# EAGLE design LARS (EAGLE 9.1.3)
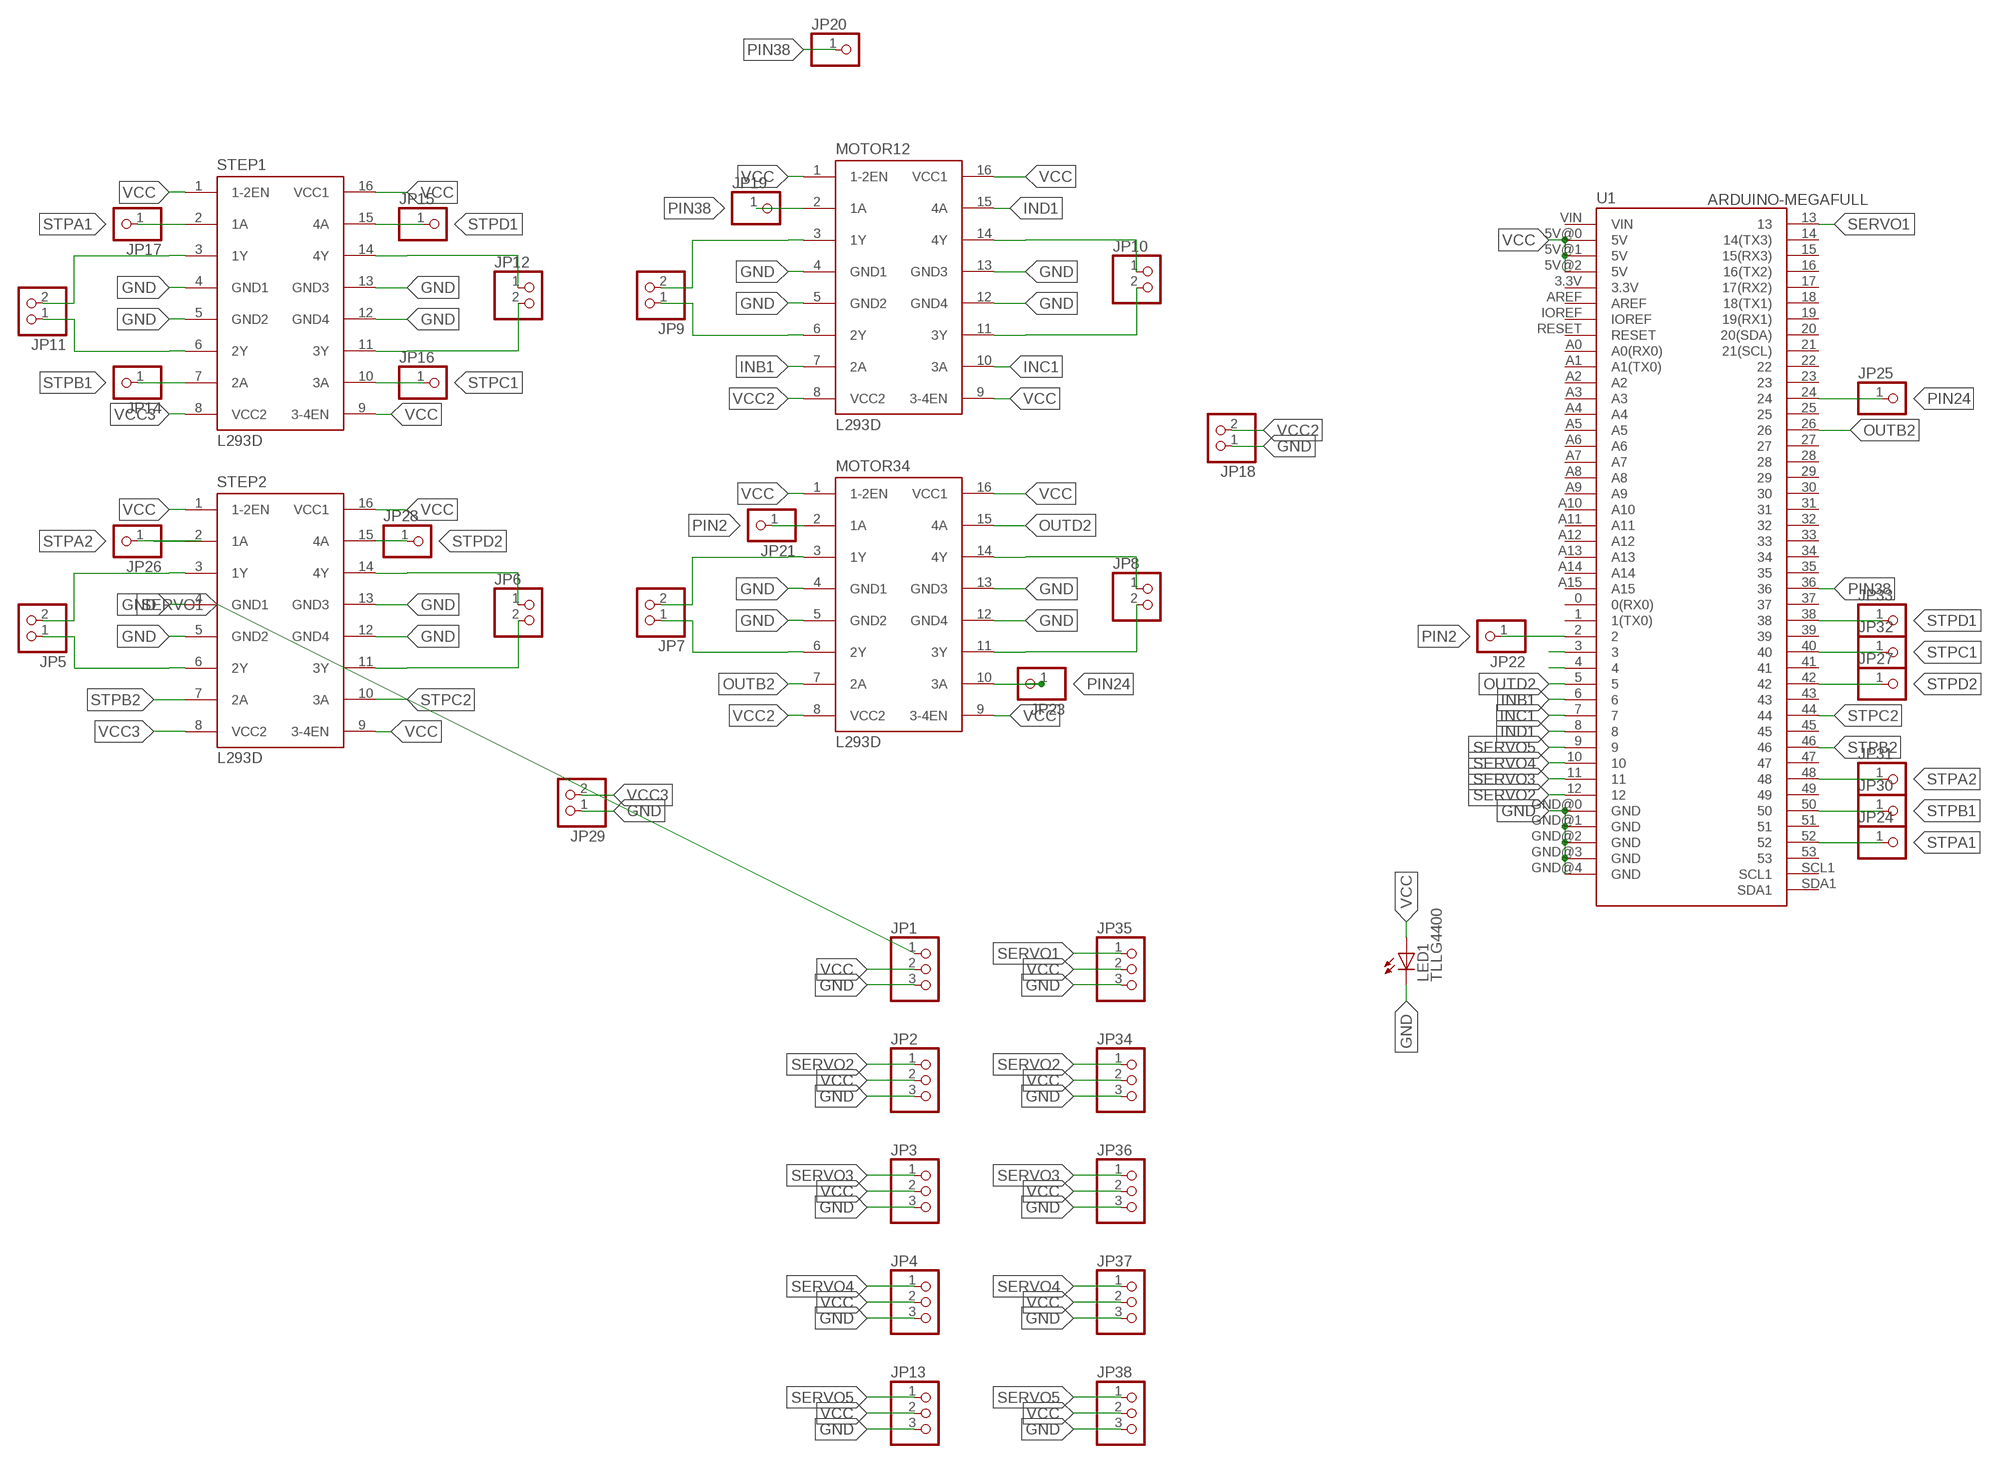
[diagram p0: schematic, sheet 1]

## Parts
JP1  PINHD-1X3  [1X03]
JP2  PINHD-1X3  [1X03]
JP3  PINHD-1X3  [1X03]
JP4  PINHD-1X3  [1X03]
JP5  PINHD-1X2  [1X02]
JP6  PINHD-1X2  [1X02]
JP7  PINHD-1X2  [1X02]
JP8  PINHD-1X2  [1X02]
JP9  PINHD-1X2  [1X02]
JP10  PINHD-1X2  [1X02]
JP11  PINHD-1X2  [1X02]
JP12  PINHD-1X2  [1X02]
JP13  PINHD-1X3  [1X03]
JP14  PINHD-1X1  [1X01]
JP15  PINHD-1X1  [1X01]
JP16  PINHD-1X1  [1X01]
JP17  PINHD-1X1  [1X01]
JP18  PINHD-1X2  [1X02]
JP19  PINHD-1X1  [1X01]
JP20  PINHD-1X1  [1X01]
JP21  PINHD-1X1  [1X01]
JP22  PINHD-1X1  [1X01]
JP23  PINHD-1X1  [1X01]
JP24  PINHD-1X1  [1X01]
JP25  PINHD-1X1  [1X01]
JP26  PINHD-1X1  [1X01]
JP27  PINHD-1X1  [1X01]
JP28  PINHD-1X1  [1X01]
JP29  PINHD-1X2  [1X02]
JP30  PINHD-1X1  [1X01]
JP31  PINHD-1X1  [1X01]
JP32  PINHD-1X1  [1X01]
JP33  PINHD-1X1  [1X01]
JP34  PINHD-1X3  [1X03]
JP35  PINHD-1X3  [1X03]
JP36  PINHD-1X3  [1X03]
JP37  PINHD-1X3  [1X03]
JP38  PINHD-1X3  [1X03]
LED1  TLLG4400  [LED3MM]
MOTOR12  L293D  [DIL16]
MOTOR34  L293D  [DIL16]
STEP1  L293D  [DIL16]
STEP2  L293D  [DIL16]
U1  ARDUINO-MEGAFULL  [ARDUINO_MEGA]

## Nets
GND: JP1.3 JP2.3 JP3.3 JP4.3 JP13.3 JP18.1 JP29.1 JP34.3 JP35.3 JP36.3 JP37.3 JP38.3 LED1.K(C) MOTOR12.4(GND1) MOTOR12.5(GND2) MOTOR12.12(GND4) MOTOR12.13(GND3) MOTOR34.4(GND1) MOTOR34.5(GND2) MOTOR34.12(GND4) MOTOR34.13(GND3) STEP1.4(GND1) STEP1.5(GND2) STEP1.12(GND4) STEP1.13(GND3) STEP2.4(GND1) STEP2.5(GND2) STEP2.12(GND4) STEP2.13(GND3) U1.GND@0(GND) U1.GND@1(GND) U1.GND@2(GND) U1.GND@3(GND) U1.GND@4(GND)
INB1: MOTOR12.7(2A) U1.6
INC1: MOTOR12.10(3A) U1.7
IND1: MOTOR12.15(4A) U1.8
N$4: U1.4
N$5: U1.3
OUTB2: MOTOR34.7(2A) U1.26
OUTD2: MOTOR34.15(4A) U1.5
PIN2: JP21.1 JP22.1 MOTOR34.2(1A) U1.2
PIN24: JP23.1 JP25.1 MOTOR34.10(3A) U1.24
PIN38: JP19.1 JP20.1 MOTOR12.2(1A) U1.36
SERVO1: JP1.1 JP35.1 U1.13
SERVO2: JP2.1 JP34.1 U1.12
SERVO3: JP3.1 JP36.1 U1.11
SERVO4: JP4.1 JP37.1 U1.10
SERVO5: JP13.1 JP38.1 U1.9
STP1: JP5.2 STEP2.3(1Y)
STP2: JP5.1 STEP2.6(2Y)
STP3: JP6.2 STEP2.11(3Y)
STP4: JP6.1 STEP2.14(4Y)
STP5: JP7.2 MOTOR34.3(1Y)
STP6: JP7.1 MOTOR34.6(2Y)
STP7: JP8.2 MOTOR34.11(3Y)
STP8: JP8.1 MOTOR34.14(4Y)
STP9: JP9.2 MOTOR12.3(1Y)
STP10: JP9.1 MOTOR12.6(2Y)
STP11: JP10.2 MOTOR12.11(3Y)
STP12: JP10.1 MOTOR12.14(4Y)
STP13: JP11.2 STEP1.3(1Y)
STP14: JP11.1 STEP1.6(2Y)
STP15: JP12.2 STEP1.11(3Y)
STP16: JP12.1 STEP1.14(4Y)
STPA1: JP17.1 JP24.1 STEP1.2(1A) U1.52
STPA2: JP26.1 JP31.1 STEP2.2(1A) U1.48
STPB1: JP14.1 JP30.1 STEP1.7(2A) U1.50
STPB2: STEP2.7(2A) U1.46
STPC1: JP16.1 JP32.1 STEP1.10(3A) U1.40
STPC2: STEP2.10(3A) U1.44
STPD1: JP15.1 JP33.1 STEP1.15(4A) U1.38
STPD2: JP27.1 JP28.1 STEP2.15(4A) U1.42
VCC: JP1.2 JP2.2 JP3.2 JP4.2 JP13.2 JP34.2 JP35.2 JP36.2 JP37.2 JP38.2 LED1.A MOTOR12.1(1-2EN) MOTOR12.9(3-4EN) MOTOR12.16(VCC1) MOTOR34.1(1-2EN) MOTOR34.9(3-4EN) MOTOR34.16(VCC1) STEP1.1(1-2EN) STEP1.9(3-4EN) STEP1.16(VCC1) STEP2.1(1-2EN) STEP2.9(3-4EN) STEP2.16(VCC1) U1.5V@0(5V) U1.5V@1(5V) U1.5V@2(5V)
VCC2: JP18.2 MOTOR12.8(VCC2) MOTOR34.8(VCC2)
VCC3: JP29.2 STEP1.8(VCC2) STEP2.8(VCC2)
Unconnected: U1.0(0(RX0)) U1.1(1(TX0)) U1.3.3V U1.14(14(TX3)) U1.15(15(RX3)) U1.16(16(TX2)) U1.17(17(RX2)) U1.18(18(TX1)) U1.19(19(RX1)) U1.20(20(SDA)) U1.21(21(SCL)) U1.22 U1.23 U1.25 U1.27 U1.28 U1.29 U1.30 U1.31 U1.32 U1.33 U1.34 U1.35 U1.37 U1.39 U1.41 U1.43 U1.45 U1.47 U1.49 U1.51 U1.53 U1.A0(A0(RX0)) U1.A1(A1(TX0)) U1.A2 U1.A3 U1.A4 U1.A5 U1.A6 U1.A7 U1.A8 U1.A9 U1.A10 U1.A11 U1.A12 U1.A13 U1.A14 U1.A15 U1.AREF U1.IOREF U1.RESET U1.SCL1 U1.SDA1 U1.VIN

## Library data of the parts
JP1-JP4 JP13 JP34-JP38 = pinhead:PINHD-1X3: PIN HEADER
JP5-JP12 JP18 JP29 = pinhead:PINHD-1X2: PIN HEADER
JP14-JP17 JP19-JP28 JP30-JP33 = pinhead:PINHD-1X1: PIN HEADER
LED1 = led:TLLG4400: Low Current (2mA) LED 3 mm Tinted Diffused Package color GREEN Source: Data sheet <http://www.farnell.com/datasheets/391098.pdf>; MF: VISHAY SEMICONDUCTOR; OC_FARNELL: 1612435
MOTOR12 MOTOR34 STEP1 STEP2 = st-microelectronics:L293D: PUSH-PULL 4 CHANNEL DRIVER; MPN: L293D; OC_FARNELL: 9589619; OC_NEWARK: 56P8249
U1 = zortness:ARDUINO-MEGA: Arduino MegaR3 board footprint. Also works for Due.

## Net classes
0 default: width 0.635 mm
1 LARS: width 1.016 mm

## Board
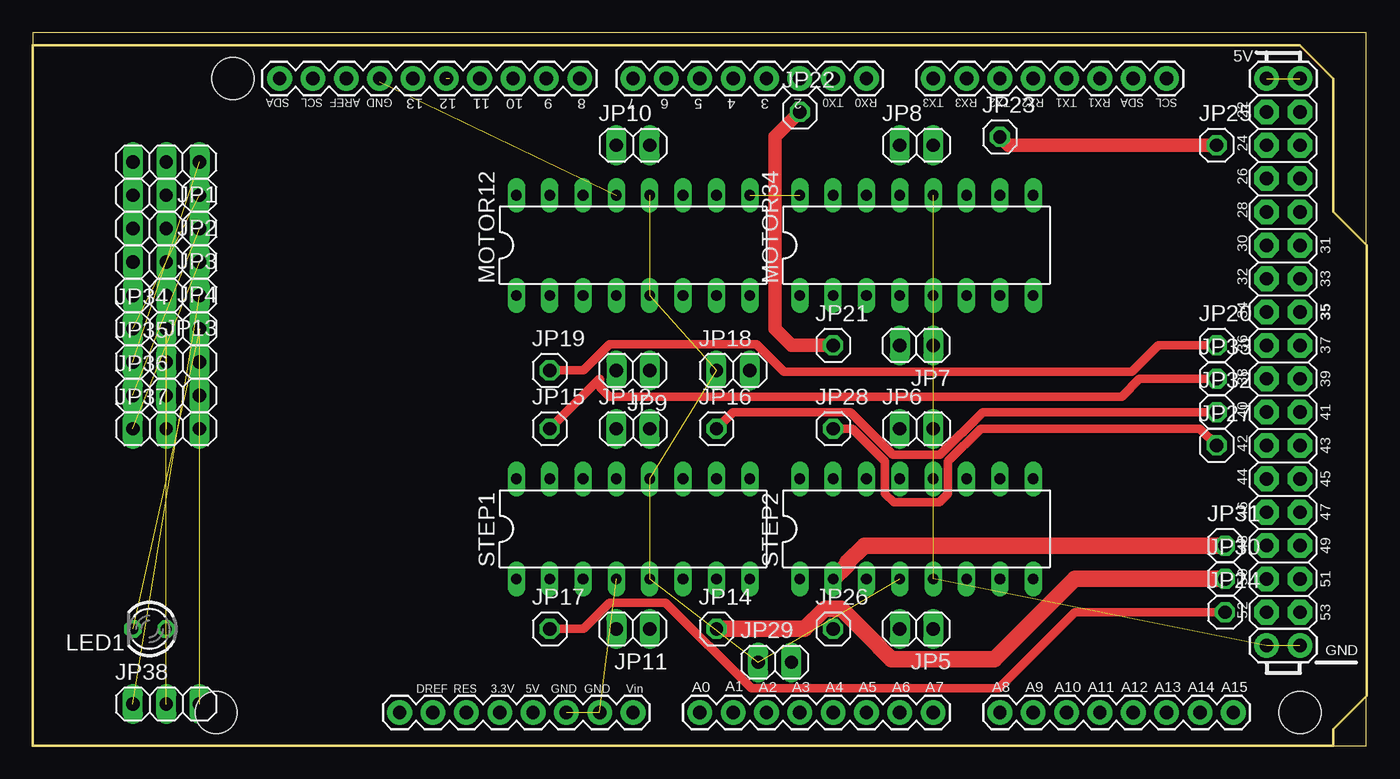
[diagram p1: board, top side]
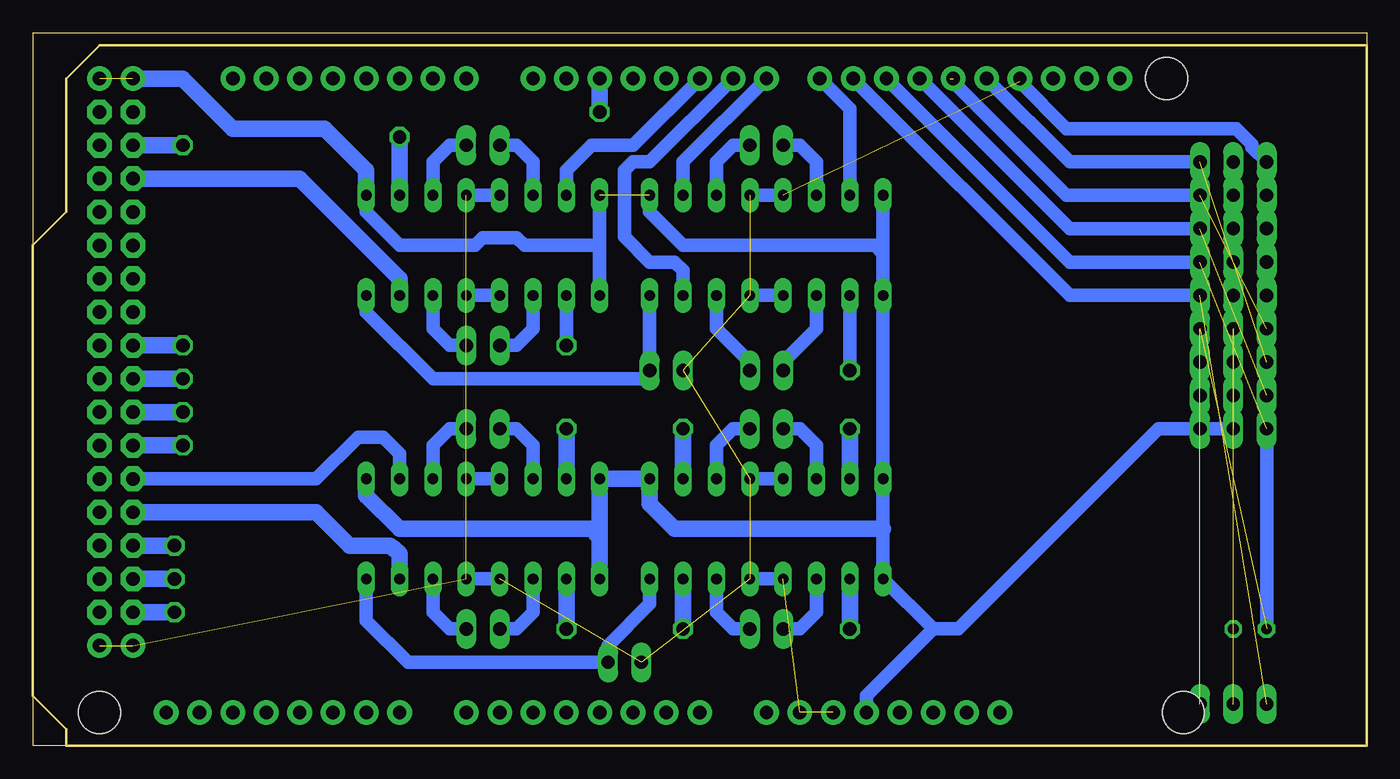
[diagram p2: board, bottom side, seen from below]

Size 101.6 x 54.28 mm. Coordinates in mm from the lower left corner, seen from the top.
Outline: 0,0 101.58,0 101.58,54.28 0,54.28 0,0
Copper layers (1*16): Top 0.035mm / dielectric 1.5mm / Bottom 0.035mm
Design rules "default": minimum track width 6mil, minimum drill 0.35mm, track to track 6mil, track to pad 6mil, pad to pad 6mil, via to via 6mil, smd to smd 6mil, copper to edge 40mil, drill to drill 6mil, minimum pad ring 10mil, minimum via ring 8mil, stop-mask expansion 4mil, vias tented up to drill 0mil, thermal gap 10mil

### Footprints (pad centres in the part's own frame; a part is rotated, then mirrored left to right if it is on the bottom)
1X03 = drill 1.016 long: 1 -2.54,0; 2 0,0; 3 2.54,0
1X02 = drill 1.016 long: 1 -1.27,0; 2 1.27,0
1X01 = drill 1.016 octagon: 1 0,0
LED3MM = drill 0.813 octagon: A -1.27,0; K 1.27,0
DIL16 = drill 0.813 long: 1 -8.89,-3.81; 2 -6.35,-3.81; 3 -3.81,-3.81; 4 -1.27,-3.81; 5 1.27,-3.81; 6 3.81,-3.81; 7 6.35,-3.81; 8 8.89,-3.81; 9 8.89,3.81; 10 6.35,3.81; 11 3.81,3.81; 12 1.27,3.81; 13 -1.27,3.81; 14 -3.81,3.81; 15 -6.35,3.81; 16 -8.89,3.81
ARDUINO_MEGA = drill 1.016 pad 1.88: 0 63.5,50.8; 1 60.96,50.8; 2 58.42,50.8; 3 55.88,50.8; 3.3V 35.56,2.54; 4 53.34,50.8; 5 50.8,50.8; 5V@0 38.1,2.54; 5V@1 93.98,50.8; 5V@2 96.52,50.8; 6 48.26,50.8; 7 45.72,50.8; 8 41.656,50.8; 9 39.116,50.8; 10 36.576,50.8; 11 34.036,50.8; 12 31.496,50.8; 13 28.956,50.8; 14 68.58,50.8; 15 71.12,50.8; 16 73.66,50.8; 17 76.2,50.8; 18 78.74,50.8; 19 81.28,50.8; 20 83.82,50.8; 21 86.36,50.8; A0 50.8,2.54; A1 53.34,2.54; A2 55.88,2.54; A3 58.42,2.54; A4 60.96,2.54; A5 63.5,2.54; A6 66.04,2.54; A7 68.58,2.54; A8 73.66,2.54; A9 76.2,2.54; A10 78.74,2.54; A11 81.28,2.54; A12 83.82,2.54; A13 86.36,2.54; A14 88.9,2.54; A15 91.44,2.54; AREF 23.876,50.8; EMPTY 27.94,2.54; GND@0 40.64,2.54; GND@1 43.18,2.54; GND@2 93.98,7.62; GND@3 96.52,7.62; GND@4 26.416,50.8; IOREF 30.48,2.54; RESET 33.02,2.54; SCL1 21.336,50.8; SDA1 18.796,50.8; VIN 45.72,2.54 | drill 1.016 pad 1.88 octagon: 22 93.98,48.26; 23 96.52,48.26; 24 93.98,45.72; 25 96.52,45.72; 26 93.98,43.18; 27 96.52,43.18; 28 93.98,40.64; 29 96.52,40.64; 30 93.98,38.1; 31 96.52,38.1; 32 93.98,35.56; 33 96.52,35.56; 34 93.98,33.02; 35 96.52,33.02; 36 93.98,30.48; 37 96.52,30.48; 38 93.98,27.94; 39 96.52,27.94; 40 93.98,25.4; 41 96.52,25.4; 42 93.98,22.86; 43 96.52,22.86; 44 93.98,20.32; 45 96.52,20.32; 46 93.98,17.78; 47 96.52,17.78; 48 93.98,15.24; 49 96.52,15.24; 50 93.98,12.7; 51 96.52,12.7; 52 93.98,10.16; 53 96.52,10.16 | hole 3.2: 15.24,50.8; 13.97,2.54; 96.52,2.54

### Placement (x,y rotation side)
JP1  10.16,44.45 180 top
JP2  10.16,41.91 180 top
JP3  10.16,39.37 180 top
JP4  10.16,36.83 180 top
JP5  67.31,8.89 180 top
JP6  67.31,24.13 0 top
JP7  67.31,30.48 180 top
JP8  67.31,45.72 0 top
JP9  45.72,28.57 180 top
JP10  45.72,45.72 0 top
JP11  45.72,8.89 180 top
JP12  45.72,24.13 0 top
JP13  10.16,34.29 180 top
JP14  52.07,8.89 0 top
JP15  39.37,24.13 0 top
JP16  52.07,24.13 0 top
JP17  39.37,8.89 0 top
JP18  53.34,28.57 0 top
JP19  39.37,28.57 0 top
JP20  90.17,30.48 0 top
JP21  60.96,30.48 0 top
JP22  58.42,48.26 0 top
JP23  73.66,46.35 0 top
JP24  90.81,10.16 0 top
JP25  90.17,45.72 0 top
JP26  60.96,8.89 0 top
JP27  90.17,22.86 0 top
JP28  60.96,24.13 0 top
JP29  56.52,6.35 0 top
JP30  90.81,12.7 0 top
JP31  90.81,15.24 0 top
JP32  90.17,25.4 0 top
JP33  90.17,27.94 0 top
JP34  10.16,31.75 0 top
JP35  10.16,29.21 0 top
JP36  10.16,26.67 0 top
JP37  10.16,24.13 0 top
JP38  10.16,3.17 0 top
LED1  8.89,8.89 180 top
MOTOR12  45.72,38.1 0 top
MOTOR34  67.31,38.1 0 top
STEP1  45.72,16.51 0 top
STEP2  67.31,16.51 0 top
U1  0,0 0 top

### Tracks (layer width: path | path; a pad name or v marks a point on that pad's centre or on a via)
GND  (19 unrouted)
  Bottom 1.016: U1.GND@4 26.42,50.55 22.86,46.99 9.93,46.99 8.74,45.8 8.74,45.57 JP1.3 JP2.3 JP3.3 JP4.3 JP13.3 LED1.K | MOTOR12.13 MOTOR12.12 | MOTOR12.4 MOTOR12.5 | STEP1.13 STEP1.12 | STEP1.4 STEP1.5 | STEP2.4 STEP2.5 | STEP2.13 STEP2.12 | MOTOR34.4 MOTOR34.5 | MOTOR34.13 MOTOR34.12
INB1
  Bottom 1.016: 56.52,40.64 56.52,38.73 54.61,36.83 52.7,36.83 52.07,36.2 MOTOR12.7 | 56.52,40.64 56.52,41.27 | 56.52,41.27 | U1.6 54.61,44.45 55.88,44.45 56.52,43.81 56.52,40.64
INC1
  Bottom 1.016: U1.7 52.07,44.45 MOTOR12.10
IND1
  Bottom 1.016: U1.8 39.37,48.51 MOTOR12.15
OUTB2
  Bottom 1.27: MOTOR34.7 73.66,35.56 81.28,43.18 U1.26
OUTD2
  Bottom 1.016: U1.5 55.88,45.72 59.05,45.72 60.96,43.81 MOTOR34.15
PIN2
  Top 1.016: JP22.1 56.52,46.35 56.52,31.75 57.78,30.48 JP21.1
  Bottom 1.016: MOTOR34.2 JP21.1
  Bottom 1.27: U1.2 JP22.1
PIN24
  Top 1.016: JP23.1 74.3,45.72 JP25.1
  Bottom 1.27: JP23.1 MOTOR34.10 | JP25.1 U1.24
PIN38
  Top 0.635: JP19.1 41.95,28.57 43.94,30.57 55.12,30.57 57.2,28.49 83.73,28.49 85.72,30.48 JP20.1
  Bottom 1.016: MOTOR12.2 JP19.1
  Bottom 1.27: JP20.1 91.44,30.48 U1.36
SERVO1  (1 unrouted)
  Bottom 1.016: JP1.1 22.61,44.45 U1.13
SERVO2  (2 unrouted)
  Bottom 1.016: JP2.1 22.86,41.91 31.75,50.8
SERVO3  (1 unrouted)
  Bottom 1.016: JP3.1 22.61,39.37 U1.11
SERVO4  (1 unrouted)
  Bottom 1.016: JP4.1 22.61,36.83 U1.10
SERVO5  (1 unrouted)
  Bottom 1.016: JP13.1 22.61,34.29 U1.9
STP1
  Bottom 1.016: JP5.2 64.77,8.89 63.5,10.16 STEP2.3
STP2
  Bottom 1.016: JP5.1 69.85,8.89 71.12,10.16 STEP2.6
STP3
  Bottom 1.016: JP6.2 69.85,24.13 71.12,22.86 STEP2.11
STP4
  Bottom 1.016: STEP2.14 63.5,22.86 64.77,24.13 JP6.1
STP5
  Bottom 1.016: MOTOR34.3 63.5,31.75 64.77,30.48 JP7.2
STP6
  Bottom 1.016: JP7.1 69.85,30.48 71.12,31.75 MOTOR34.6
STP7
  Bottom 1.016: JP8.2 69.85,45.72 71.12,44.45 MOTOR34.11
STP8
  Bottom 1.016: MOTOR34.14 63.5,44.45 64.77,45.72 JP8.1
STP9
  Bottom 1.016: MOTOR12.3 41.91,31.75 44.45,29.21 JP9.2
STP10
  Bottom 1.016: JP9.1 46.99,29.21 49.53,31.75 MOTOR12.6
STP11
  Bottom 1.016: JP10.2 48.26,45.72 49.53,44.45 MOTOR12.11
STP12
  Bottom 1.016: MOTOR12.14 41.91,44.45 43.18,45.72 JP10.1
STP13
  Bottom 1.016: STEP1.3 41.91,10.16 43.18,8.89 JP11.2
STP14
  Bottom 1.016: JP11.1 48.26,8.89 49.53,10.16 STEP1.6
STP15
  Bottom 1.016: JP12.2 48.26,24.13 49.53,22.86 STEP1.11
STP16
  Bottom 1.016: STEP1.14 41.91,22.86 43.18,24.13 JP12.1
STPA1
  Top 0.635: JP17.1 41.95,8.89 43.94,10.88 48.21,10.88 54.73,4.36 73.57,4.36 79.38,10.16 JP24.1
  Bottom 1.27: JP24.1 U1.52 | STEP1.2 JP17.1
STPA2
  Top 1.27: STEP2.2 62.05,13.79 62.05,13.96 63.33,15.24 JP31.1
  Bottom 1.27: STEP2.2 JP26.1 | JP31.1 U1.48
STPB1
  Top 1.27: JP14.1 58.77,8.89 60.32,10.44 61.6,10.44 64.49,7.55 64.49,7.49 65.4,6.58 73.25,6.58 79.38,12.7 JP30.1
  Bottom 1.27: JP30.1 U1.50 | STEP1.7 JP14.1
STPB2
  Bottom 1.27: STEP2.7 73.66,14.61 74.14,15.09 74.25,15.09 74.4,15.24 77.47,15.24 80.01,17.78 U1.46
STPC1
  Top 0.635: JP16.1 53.34,25.4 62.27,25.4 65.53,22.14 69.09,22.14 72.35,25.4 JP32.1
  Bottom 1.27: JP32.1 U1.40 | JP16.1 STEP1.10
STPC2
  Bottom 1.016: STEP2.10 73.66,22.23 74.93,23.5 76.83,23.5 80.01,20.32 U1.44
STPD1
  Top 0.635: JP15.1 43.18,27.94 43.22,27.9 43.22,27.3 43.94,26.58 82.94,26.58 84.3,27.94 JP33.1
  Bottom 1.27: JP33.1 U1.38 | JP15.1 STEP1.15
STPD2
  Top 0.635: JP27.1 88.9,24.13 72.2,24.13 69.71,21.64 69.71,19.19 69.05,18.53 65.57,18.53 64.91,19.19 64.91,21.64 62.42,24.13 JP28.1
  Bottom 1.27: JP27.1 U1.42 | JP28.1 STEP2.15
VCC  (7 unrouted)
  Bottom 1.016: JP1.2 JP2.2 JP3.2 JP4.2 JP13.2 JP37.2 15.88,24.13 31.11,8.89 | 36.83,37.47 MOTOR12.1 STEP1.16 36.83,16.51 STEP1.1 33.02,8.89 | 36.83,37.47 MOTOR12.16 | MOTOR12.9 54.61,40.64 52.07,38.1 37.47,38.1 36.83,37.47 | MOTOR34.16 58.42,38.1 | 58.42,38.1 MOTOR34.1 | 58.42,38.1 64.16,38.1 64.75,38.68 67.33,38.68 67.92,38.1 73.66,38.1 76.2,40.64 MOTOR34.9 | 31.11,8.89 31.75,8.89 | 31.75,8.89 | 31.11,8.89 33.02,8.89 | U1.5V@0 38.1,3.81 33.02,8.89
  Bottom 1.27: U1.5V@1 90.17,50.8 86.36,46.99 79.38,46.99 76.2,43.81 MOTOR34.9 | 36.83,16.51 52.7,16.51 54.61,18.41 STEP1.9 STEP2.16 58.42,15.88 | 58.42,15.88 STEP2.1 | 58.42,15.88 59.05,16.51 73.66,16.51 76.2,19.05 STEP2.9
VCC2
  Bottom 1.016: MOTOR12.8 JP18.2 55.24,27.94 71.12,27.94 76.2,33.02 MOTOR34.8
VCC3
  Bottom 1.016: STEP1.8 54.61,10.79 57.78,7.62 JP29.2 73.03,6.35 76.2,9.53 STEP2.8